# Altium schematic sheet power section.SchDoc
size A4; SheetNumber: 2; SheetTotal: 2; SPICEModelCacheHSXGUZGB: <root> / <DocumentId>HSXGUZGB</DocumentId> / </root>
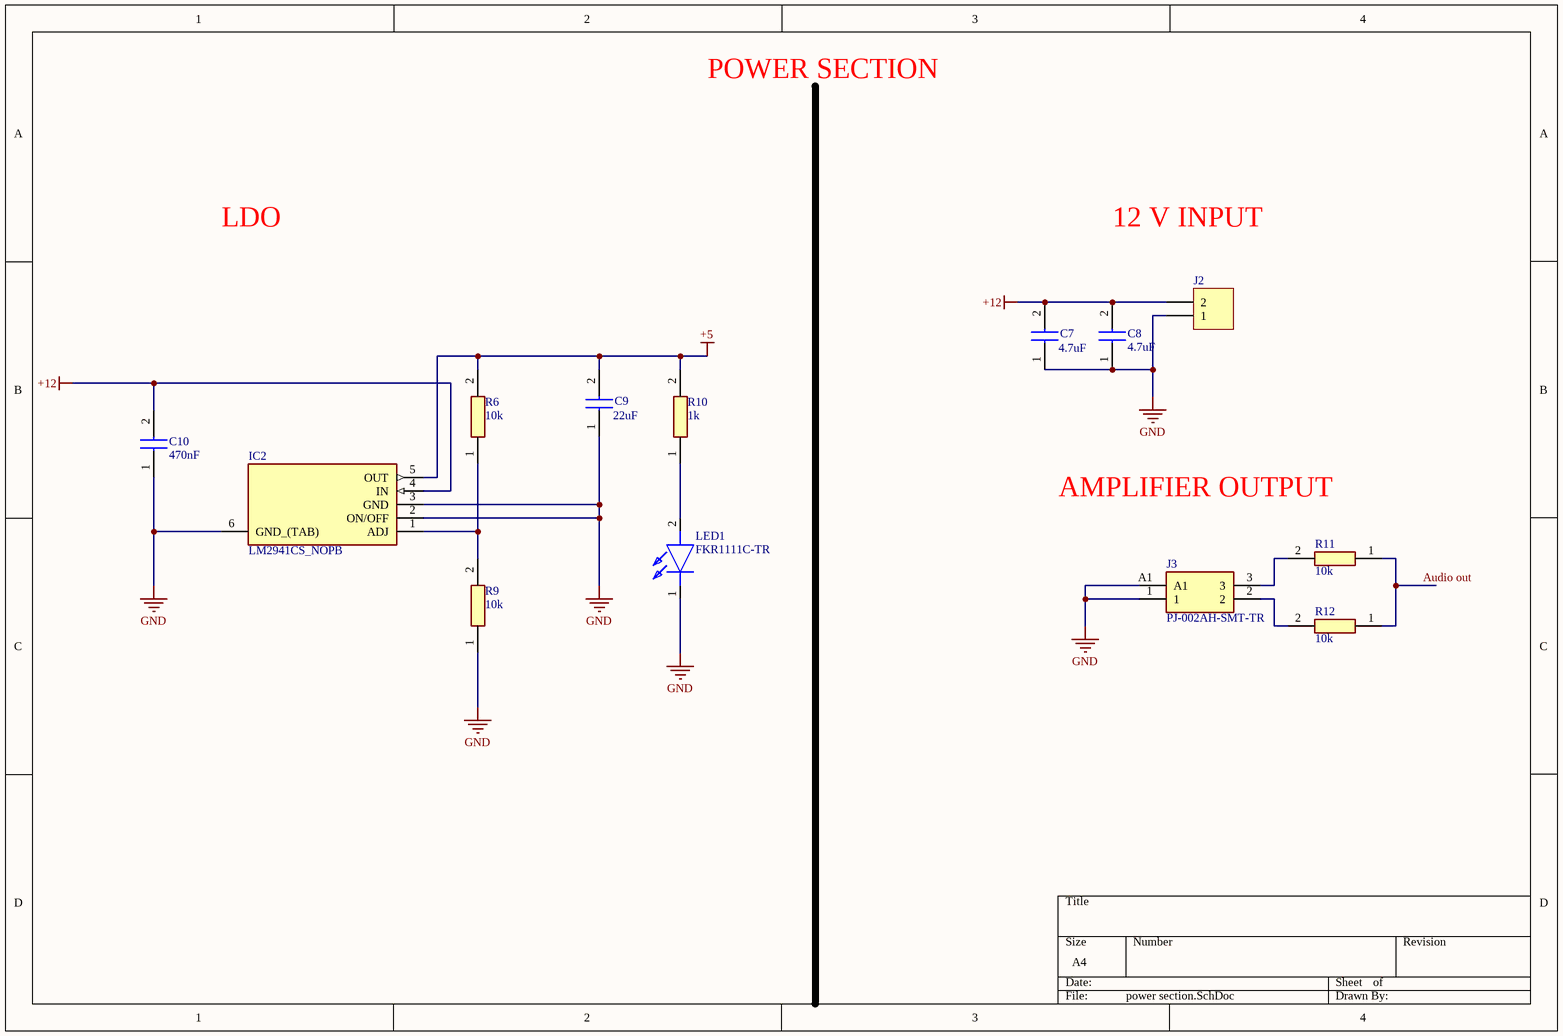
[diagram p0: power section.SchDoc]

## Parts
C7  4.7uF  [CAPC1608X90N]
C8  4.7uF  [CAPC1608X90N]
C9  22uF  [CAPC1608X90N]
C10  470nF  [CAPC1608X90N]
IC2  LM2941CS_NOPB  [TO170P1435X465-6N]
J2  (no value)  [CON2_P196_1729128_TH_ST]
J3  PJ-002AH-SMT-TR  [PJ002AHSMTTR]
LED1  FKR1111C-TR  [LEDC1608X80N]
R6  10k  [ERA3AEB101V]
R9  10k  [ERA3AEB101V]
R10  1k  [ERA3AEB101V]
R11  10k  [ERA3AEB101V]
R12  10k  [ERA3AEB101V]

## Nets
+5: C9.2 IC2.5(OUT) R6.2 R10.2
+12: C7.2 C8.2 C10.2 IC2.4(IN) J2.2
GND: C7.1 C8.1 C9.1 C10.1 IC2.2(ON/OFF) IC2.3(GND) IC2.6(GND_(TAB)) J2.1 J3.1 J3.A1 LED1.1(K) R9.1
Audio out: R11.1 R12.1
NetIC2_1: IC2.1(ADJ) R6.1 R9.2
NetJ3_2: J3.2 R12.2
NetJ3_3: J3.3 R11.2
NetLED1_2: LED1.2(A) R10.1

## Notes on the sheet
- POWER SECTION
- LDO
- 12 V INPUT
- AMPLIFIER OUTPUT

## Library data of the parts
C7-C10 = GRM188R71C104MA01D: Capacitor; Manufacturer_Name: Murata Electronics; Datasheet Link: http://componentsearchengine.com/Datasheets/1/GRM188R71C104MA01D.pdf; Height: 0.9mm; Manufacturer_Part_Number: GRM188R71C104MA01D; Mouser Part Number: 81-GRM18R71C104MA01D; Mouser Price/Stock: https://www.mouser.com/Search/Refine.aspx?Keyword=81-GRM18R71C104MA01D; Arrow Part Number: GRM188R71C104MA01D; Arrow Price/Stock: https://www.arrow.com/en/products/grm188r71c104ma01d/murata-manufacturing
IC2 = LM2941CS_NOPB: Integrated Circuit; Manufacturer_Name: Texas Instruments; Manufacturer_Part_Number: LM2941CS/NOPB; Datasheet Link: http://www.ti.com/lit/ds/symlink/lm2941c.pdf; Height: 4.65mm; Mouser Part Number: 926-LM2941CS/NOPB; Mouser Price/Stock: https://www.mouser.co.uk/ProductDetail/Texas-Instruments/LM2941CS-NOPB?qs=X1J7HmVL2ZH2r4C4M%252B7C2A%3D%3D; Arrow Part Number: LM2941CS/NOPB; Arrow Price/Stock: https://www.arrow.com/en/products/lm2941csnopb/texas-instruments?utm_currency=USD&region=europe
J2 = CON-TB_2X1-196-ST-TH: 2 Pins, 1 Row 5mm Pitch, straight Connector, male; Manufacturer: Phoenix Contact; Manufacturer Part Number: MKDSN1,5/2; Alternate Part Number-1: NA; Case/Package: TH-CON; Supplier-1: SP ROAD; Supplier Part Number-1: MKDSN1,5/2
J3 = PJ-002AH-SMT-TR: Connector; Manufacturer_Name: Same Sky; Datasheet Link: https://www.sameskydevices.com/product/resource/supplyframepdf/pj-002ah-smt-tr.pdf; Height: 11.1mm; Manufacturer_Part_Number: PJ-002AH-SMT-TR; Mouser Part Number: 490-PJ-002AH-SMT-TR; Mouser Price/Stock: https://www.mouser.co.uk/ProductDetail/Same-Sky/PJ-002AH-SMT-TR?qs=WyjlAZoYn52i5LSWfoFS9w%3D%3D; Arrow Part Number: PJ-002AH-SMT-TR; Arrow Price/Stock: https://www.arrow.com/en/products/pj-002ah-smt-tr/cui-devices?utm_currency=USD&region=europe
LED1 = FKR1111C-TR: LED; Manufacturer_Name: Stanley Electric; Datasheet Link: http://www.stanley-components.com/php/downloaddatafile.php?rp=0,FKR1111C-TR_e.pdf; Height: 0.8mm; Manufacturer_Part_Number: FKR1111C-TR; Mouser Part Number: 327-FKR1111CTR; Mouser Price/Stock: https://www.mouser.co.uk/ProductDetail/Stanley-Electric/FKR1111C-TR?qs=byeeYqUIh0N4LNttpqKOoA%3D%3D; Arrow Part Number: FKR1111C-TR; Arrow Price/Stock: https://www.arrow.com/en/products/fkr1111c-tr/stanley-electric?region=nac
R6 R9-R12 = ERA-3AED102V: Resistor; Manufacturer_Name: Panasonic; Datasheet Link: https://industrial.panasonic.com/cdbs/www-data/pdf/RDM0000/AOA0000C307.pdf; Height: 0.55mm; Manufacturer_Part_Number: ERA-3AED102V; Mouser Part Number: 667-ERA-3AED102V; Mouser Price/Stock: https://www.mouser.co.uk/ProductDetail/Panasonic/ERA-3AED102V?qs=yocZuyCaXdNrh6oeFjCchg%3D%3D; Arrow Part Number: ERA-3AED102V; Arrow Price/Stock: https://www.arrow.com/en/products/era3aed102v/panasonic?region=nac